# Altium schematic sheet 4.SchDoc
size A4; SheetNumber: 4; SheetTotal: 5
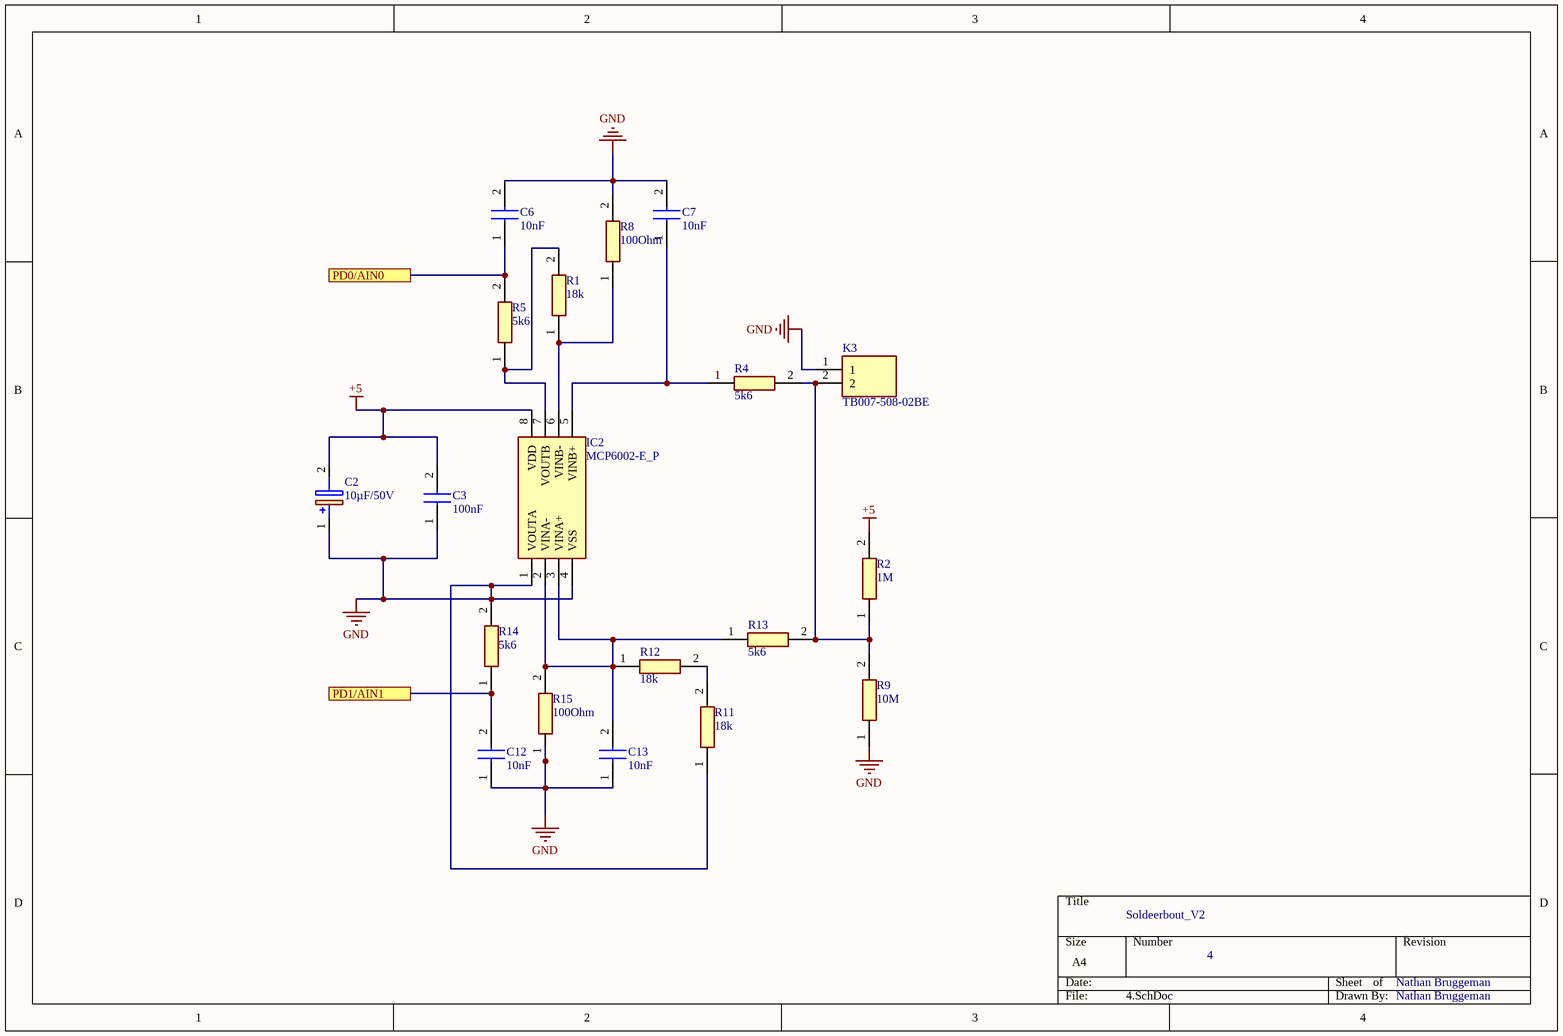
[diagram p0: 4.SchDoc]

## Parts
C2  10µF/50V  [CAPPRD200W55D500H1200]
C3  100nF  [0805]
C6  10nF  [0805]
C7  10nF  [0805]
C12  10nF  [0805]
C13  10nF  [0805]
IC2  MCP6002-E_P  [DIP781W56P254L950H533Q8N]
K3  TB007-508-02BE  [TB00750802BE]
R1  18k  [0805]
R2  1M  [0805]
R4  5k6  [0805]
R5  5k6  [0805]
R8  100Ohm  [0805]
R9  10M  [0805]
R11  18k  [0805]
R12  18k  [0805]
R13  5k6  [0805]
R14  5k6  [0805]
R15  100Ohm  [0805]

## Ports
PD0/AIN0, PD1/AIN1

## Nets
+5: C2.2(-) C3.2 IC2.8(VDD) R2.2
GND: C2.1(+) C3.1 C6.2 C7.2 C12.1 C13.1 IC2.1(VOUTA) IC2.4(VSS) K3.1 R8.2 R9.1 R11.1 R14.2 R15.1
PD0/AIN0: C6.1 R5.2 ; port PD0/AIN0
PD1/AIN1: C12.2 R14.1 ; port PD1/AIN1
NetC7_1: C7.1 IC2.5(VINB+) R4.1
NetC13_2: C13.2 IC2.2(VINA-) IC2.3(VINA+) R12.1 R13.1 R15.2
NetIC2_6: IC2.6(VINB-) R1.1 R8.1
NetIC2_7: IC2.7(VOUTB) R1.2 R5.1
NetK3_2: K3.2 R2.1 R4.2 R9.2 R13.2
NetR11_2: R11.2 R12.2

## Notes on the sheet
- Soldeerbout_V2
- 4
- Nathan Bruggeman

## Library data of the parts
C2 = ECA-1HM100: Capacitor Polarised; Manufacturer_Name: Panasonic; Datasheet Link: https://componentsearchengine.com//ECA-1HM100.pdf; Height: 12mm; Mouser2 Part Number: 667-ECA-1HM100; Mouser2 Price/Stock: https://www.mouser.com/Search/Refine.aspx?Keyword=667-ECA-1HM100; Manufacturer_Part_Number: ECA-1HM100
C3 C6 C7 C12 C13 = C0805C301G5GACTU: Capacitor; Manufacturer_Name: Kemet; Datasheet Link: https://connect.kemet.com:7667/gateway/IntelliData-ComponentDocumentation/1.0/download/specsheet/C0805C301G5GACTU; Height: 0.88mm; Manufacturer_Part_Number: C0805C301G5GACTU
IC2 = MCP6002-E_P: Integrated Circuit; Manufacturer_Name: Microchip; Manufacturer_Part_Number: MCP6002-E/P; Datasheet Link: https://componentsearchengine.com//MCP6002-E_P.pdf; Height: 5.334mm; Mouser2 Part Number: 579-MCP6002-E/P; Mouser2 Price/Stock: https://www.mouser.com/Search/Refine.aspx?Keyword=579-MCP6002-E%2FP
K3 = TB007-508-02BE: Connector; Manufacturer_Name: CUI Inc.; Datasheet Link: https://componentsearchengine.com//TB007-508-02BE.pdf; Height: 14mm; Mouser2 Part Number: 490-TB007-508-02BE; Mouser2 Price/Stock: https://www.mouser.com/Search/Refine.aspx?Keyword=490-TB007-508-02BE; Manufacturer_Part_Number: TB007-508-02BE
R1 R2 R4 R5 R8 R9 R11-R15 = CFN0805-FZ-R030ELF: Resistor; Manufacturer_Name: Bourns; Datasheet Link: https://www.bourns.com/docs/Product-Datasheets/CFN.pdf; Height: 0.9mm; Manufacturer_Part_Number: CFN0805-FZ-R030ELF